# EAGLE design Emetteur2.2 (EAGLE 7.7.0)

## Sheet 1 of 2
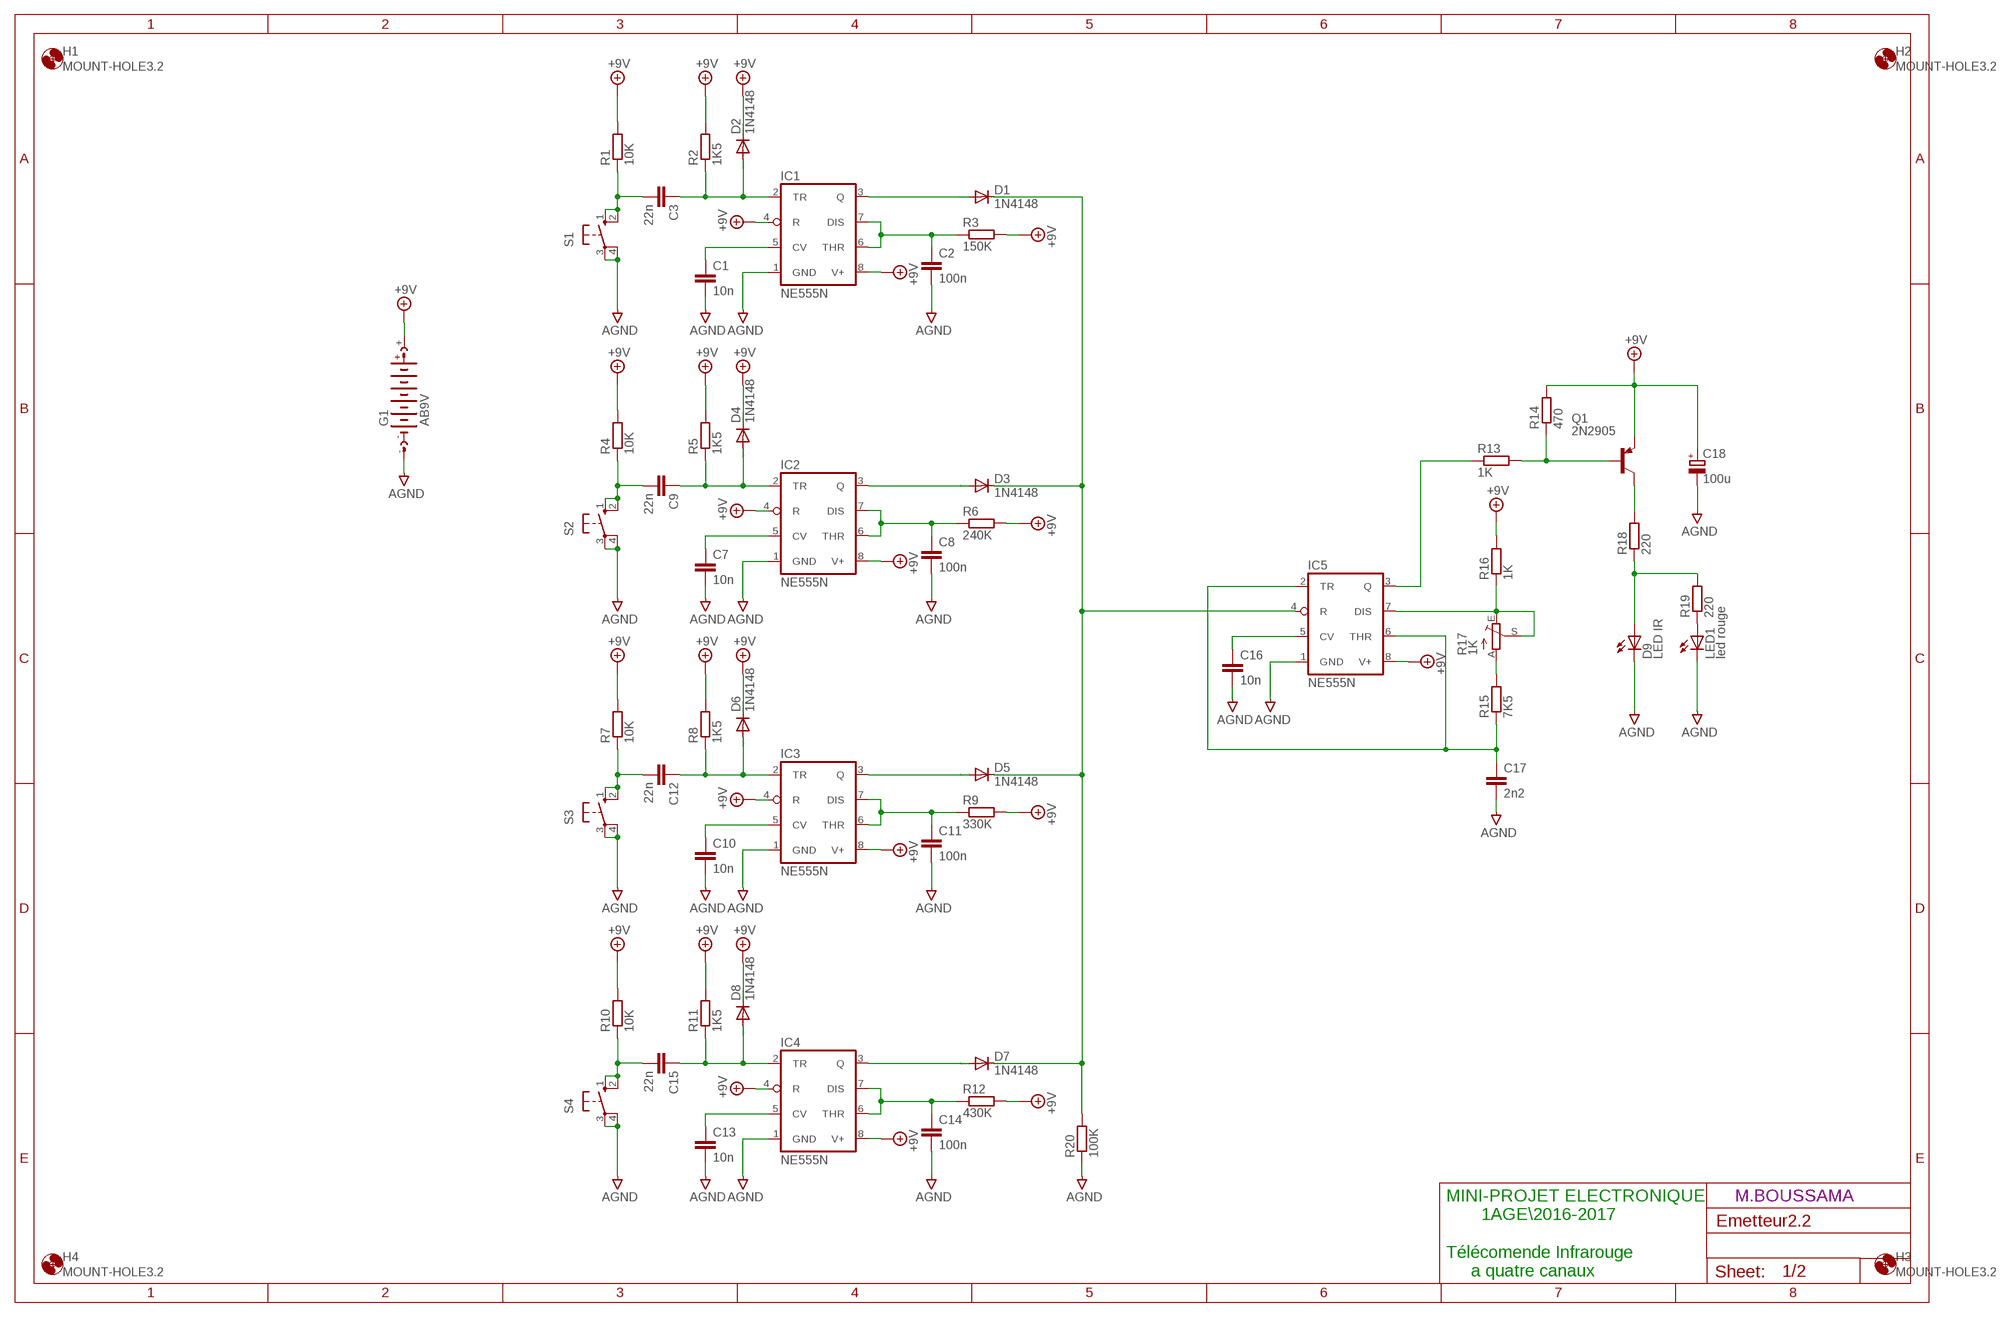
[diagram p0: schematic, sheet 1]

### Parts
C1  10n  C-EU050-025X075  [C050-025X075]
C2  100n  C-EU050-030X075  [C050-030X075]
C3  22n  C-EU050-025X075  [C050-025X075]
C7  10n  C-EU050-025X075  [C050-025X075]
C8  100n  C-EU050-030X075  [C050-030X075]
C9  22n  C-EU050-025X075  [C050-025X075]
C10  10n  C-EU050-025X075  [C050-025X075]
C11  100n  C-EU050-030X075  [C050-030X075]
C12  22n  C-EU050-025X075  [C050-025X075]
C13  10n  C-EU050-025X075  [C050-025X075]
C14  100n  C-EU050-030X075  [C050-030X075]
C15  22n  C-EU050-025X075  [C050-025X075]
C16  10n  C-EU050-025X075  [C050-025X075]
C17  2n2  C-EU050-025X075  [C050-025X075]
C18  100u  CPOL-EUE5-4  [E5-4]
D1  1N4148  1N4148DO35-7  [DO35-7]
D2  1N4148  1N4148DO35-7  [DO35-7]
D3  1N4148  1N4148DO35-7  [DO35-7]
D4  1N4148  1N4148DO35-7  [DO35-7]
D5  1N4148  1N4148DO35-7  [DO35-7]
D6  1N4148  1N4148DO35-7  [DO35-7]
D7  1N4148  1N4148DO35-7  [DO35-7]
D8  1N4148  1N4148DO35-7  [DO35-7]
D9  LED IR  SFH482  [SFH482]
G1  AB9V  [AB9V]
H1  MOUNT-HOLE3.2  [3,2]
H2  MOUNT-HOLE3.2  [3,2]
H3  MOUNT-HOLE3.2  [3,2]
H4  MOUNT-HOLE3.2  [3,2]
IC1  NE555N  [DIL08]
IC2  NE555N  [DIL08]
IC3  NE555N  [DIL08]
IC4  NE555N  [DIL08]
IC5  NE555N  [DIL08]
LED1  led rouge  LED3MM  [LED3MM]
Q1  2N2905  [TO5]
R1  10K  R-EU_0207/12  [0207/12]
R2  1K5  R-EU_0207/10  [0207/10]
R3  150K  R-EU_0204/7  [0204/7]
R4  10K  R-EU_0207/12  [0207/12]
R5  1K5  R-EU_0207/10  [0207/10]
R6  240K  R-EU_0204/7  [0204/7]
R7  10K  R-EU_0207/12  [0207/12]
R8  1K5  R-EU_0207/10  [0207/10]
R9  330K  R-EU_0204/7  [0204/7]
R10  10K  R-EU_0207/12  [0207/12]
R11  1K5  R-EU_0207/10  [0207/10]
R12  430K  R-EU_0204/7  [0204/7]
R13  1K  R-EU_0207/12  [0207/12]
R14  470  R-EU_0207/10  [0207/10]
R15  7K5  R-EU_0207/10  [0207/10]
R16  1K  R-EU_0207/12  [0207/12]
R17  1K  TRIM_EU-B25P  [B25P]
R18  220  R-EU_0207/10  [0207/10]
R19  220  R-EU_0207/10  [0207/10]
R20  100K  R-EU_0207/10  [0207/10]
S1  10-XX  [B3F-10XX]
S2  10-XX  [B3F-10XX]
S3  10-XX  [B3F-10XX]
S4  10-XX  [B3F-10XX]

### Nets
+9V: C18.+ D2.C D4.C D6.C D8.C G1.+ IC1.4(R) IC1.8(V+) IC2.4(R) IC2.8(V+) IC3.4(R) IC3.8(V+) IC4.4(R) IC4.8(V+) IC5.8(V+) Q1.1(E) R1.2 R2.2 R3.2 R4.2 R5.2 R6.2 R7.2 R8.2 R9.2 R10.2 R11.2 R12.2 R14.2 R16.2
AGND: C1.2 C2.2 C7.2 C8.2 C10.2 C11.2 C13.2 C14.2 C16.2 C17.2 C18.- D9.K(C) G1.- IC1.1(GND) IC2.1(GND) IC3.1(GND) IC4.1(GND) IC5.1(GND) LED1.K(C) R20.1 S1.3(P) S1.4(P1) S2.3(P) S2.4(P1) S3.3(P) S3.4(P1) S4.3(P) S4.4(P1)
N$1: C1.1 IC1.5(CV)
N$2: C3.1 D2.A IC1.2(TR) R2.1
N$3: C2.1 IC1.6(THR) IC1.7(DIS) R3.1
N$4: C3.2 R1.1 S1.1(S) S1.2(S1)
N$5: D1.A IC1.3(Q)
N$6: IC5.3(Q) R13.1
N$7: C7.1 IC2.5(CV)
N$8: C9.1 D4.A IC2.2(TR) R5.1
N$9: C8.1 IC2.6(THR) IC2.7(DIS) R6.1
N$10: C9.2 R4.1 S2.1(S) S2.2(S1)
N$11: D3.A IC2.3(Q)
N$12: D1.C D3.C D5.C D7.C IC5.4(R) R20.2
N$13: C10.1 IC3.5(CV)
N$14: C12.1 D6.A IC3.2(TR) R8.1
N$15: C11.1 IC3.6(THR) IC3.7(DIS) R9.1
N$16: C12.2 R7.1 S3.1(S) S3.2(S1)
N$17: D5.A IC3.3(Q)
N$18: Q1.3(C) R18.2
N$19: C13.1 IC4.5(CV)
N$20: C15.1 D8.A IC4.2(TR) R11.1
N$21: C14.1 IC4.6(THR) IC4.7(DIS) R12.1
N$22: C15.2 R10.1 S4.1(S) S4.2(S1)
N$23: D7.A IC4.3(Q)
N$24: R15.2 R17.A
N$25: C16.1 IC5.5(CV)
N$26: C17.1 IC5.2(TR) IC5.6(THR) R15.1
N$27: IC5.7(DIS) R16.1 R17.E R17.S
N$28: Q1.2(B) R13.2 R14.1
N$29: D9.A R18.1 R19.2
N$30: LED1.A R19.1

### Notes on the sheet
- M.BOUSSAMA
- MINI-PROJET ELECTRONIQUE 
         1AGE\2016-2017
  
  Télécomende Infrarouge 
       a quatre canaux

## Sheet 2 of 2
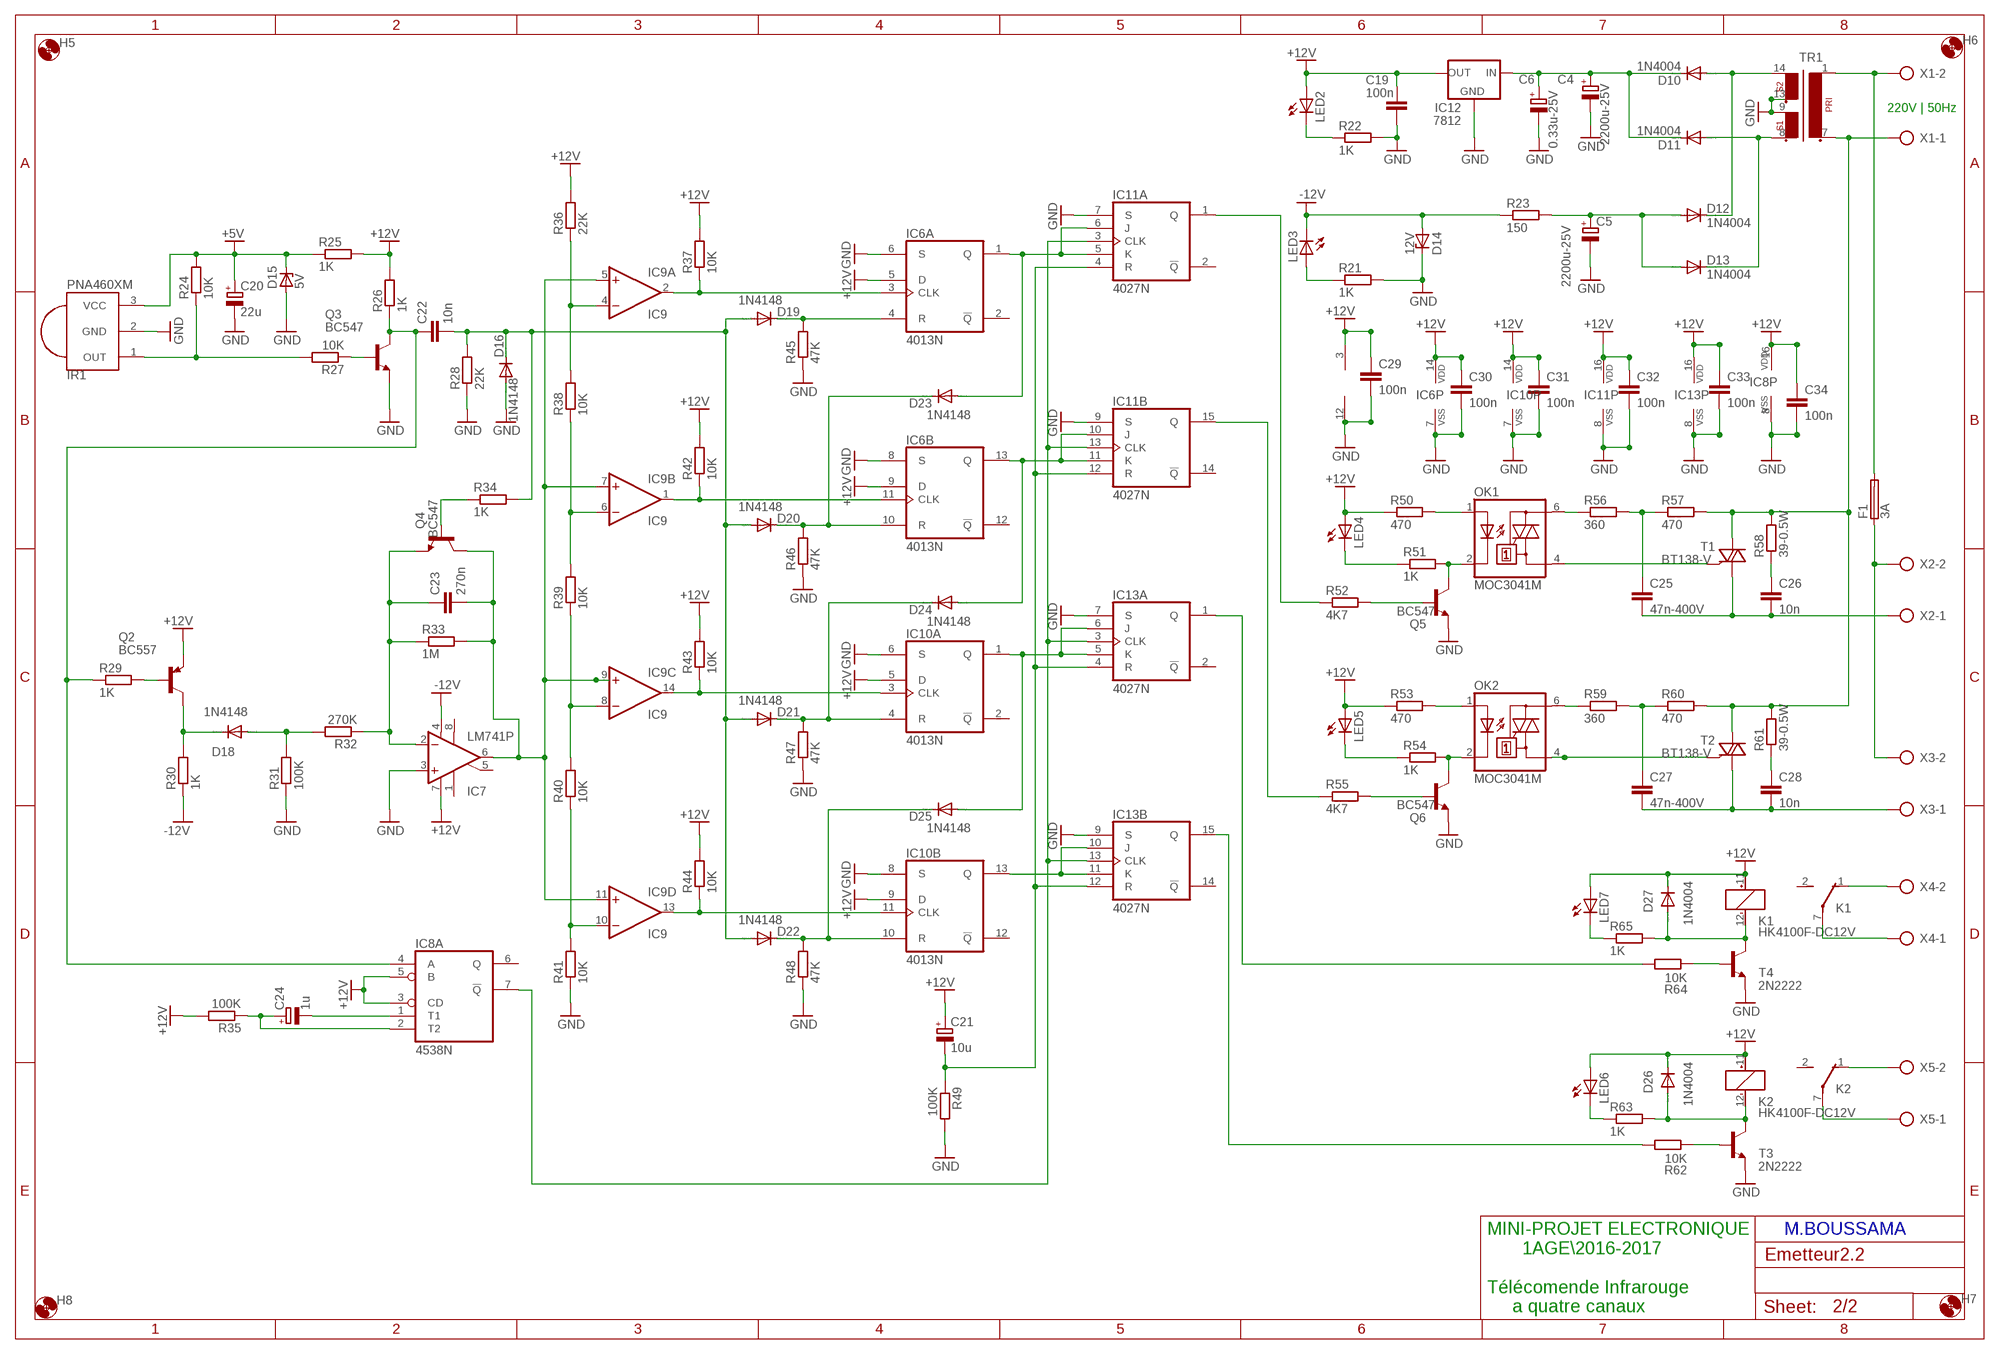
[diagram p1: schematic, sheet 2]

### Parts
C4  2200u-25V  CPOL-EUE5-13  [E5-13]
C5  2200u-25V  CPOL-EUE5-13  [E5-13]
C6  0.33u-25V  CPOL-EUE5-5  [E5-5]
C19  100n  C-EU050-025X075  [C050-025X075]
C20  22u  CPOL-EUE2.5-6  [E2,5-6]
C21  10u  CPOL-EUE2,5-6E  [E2,5-6E]
C22  10n  C-EU050-025X075  [C050-025X075]
C23  270n  C-EU050-035X075  [C050-035X075]
C24  1u  CPOL-EUE2,5-6E  [E2,5-6E]
C25  47n-400V  C-EU150-054X183  [C150-054X183]
C26  10n  C-EU102-043X133  [C102-043X133]
C27  47n-400V  C-EU150-054X183  [C150-054X183]
C28  10n  C-EU102-043X133  [C102-043X133]
C29  100n  C-EU050-025X075  [C050-025X075]
C30  100n  C-EU050-025X075  [C050-025X075]
C31  100n  C-EU050-025X075  [C050-025X075]
C32  100n  C-EU050-025X075  [C050-025X075]
C33  100n  C-EU050-025X075  [C050-025X075]
C34  100n  C-EU050-025X075  [C050-025X075]
D10  1N4004  [DO41-10]
D11  1N4004  [DO41-10]
D12  1N4004  [DO41-10]
D13  1N4004  [DO41-10]
D14  12V  1N4728  [DO41Z10]
D15  5V  1N4728  [DO41Z10]
D16  1N4148  1N4148DO35-10  [DO35-10]
D18  1N4148  1N4148DO35-7  [DO35-7]
D19  1N4148  1N4148DO35-10  [DO35-10]
D20  1N4148  BY609  [SOD61B]
D21  1N4148  1N4148DO35-10  [DO35-10]
D22  1N4148  BY609  [SOD61B]
D23  1N4148  1N4148DO35-10  [DO35-10]
D24  1N4148  BY609  [SOD61B]
D25  1N4148  1N4148DO35-10  [DO35-10]
D26  1N4004  [DO41-10]
D27  1N4004  [DO41-10]
F1  3A  FUSEGSH15  [GSH15]
H5  MOUNT-HOLE3.2  [3,2]
H6  MOUNT-HOLE3.2  [3,2]
H7  MOUNT-HOLE3.2  [3,2]
H8  MOUNT-HOLE3.2  [3,2]
IC6  4013N  [DIL14]
IC7  LM741P  [DIL08]
IC8  4538N  [DIL16]
IC9  IC9  LM339N  [DIL14]
IC10  4013N  [DIL14]
IC11  4027N  [DIL16]
IC12  7812  78XXS  [78XXS]
IC13  4027N  [DIL16]
IR1  PNA460XM  [PNA460XM]
K1  HK4100F-DC12V  [SMR1]
K2  HK4100F-DC12V  [SMR1]
LED2  LED3MM  [LED3MM]
LED3  LED3MM  [LED3MM]
LED4  LED3MM  [LED3MM]
LED5  LED3MM  [LED3MM]
LED6  LED3MM  [LED3MM]
LED7  LED3MM  [LED3MM]
OK1  MOC3041M  [DIL06]
OK2  MOC3041M  [DIL06]
Q2  BC557  [TO92-EBC]
Q3  BC547  BC548  [TO92-EBC]
Q4  BC547  BC548  [TO92-EBC]
Q5  BC547  BC548  [TO92-EBC]
Q6  BC547  BC548  [TO92-EBC]
R21  1K  R-EU_0207/10  [0207/10]
R22  1K  R-EU_0207/10  [0207/10]
R23  150  R-EU_0207/10  [0207/10]
R24  10K  R-EU_0207/10  [0207/10]
R25  1K  R-EU_0207/10  [0207/10]
R26  1K  R-EU_0207/12  [0207/12]
R27  10K  R-EU_0207/10  [0207/10]
R28  22K  R-EU_0207/10  [0207/10]
R29  1K  R-EU_0207/15  [0207/15]
R30  1K  R-EU_0207/10  [0207/10]
R31  100K  R-EU_0207/10  [0207/10]
R32  270K  R-EU_0207/12  [0207/12]
R33  1M  R-EU_0207/10  [0207/10]
R34  1K  R-EU_0207/12  [0207/12]
R35  100K  R-EU_0207/10  [0207/10]
R36  22K  R-EU_0207/10  [0207/10]
R37  10K  R-EU_0207/10  [0207/10]
R38  10K  R-EU_0207/10  [0207/10]
R39  10K  R-EU_0207/10  [0207/10]
R40  10K  R-EU_0207/10  [0207/10]
R41  10K  R-EU_0207/10  [0207/10]
R42  10K  R-EU_0207/10  [0207/10]
R43  10K  R-EU_0207/10  [0207/10]
R44  10K  R-EU_0207/10  [0207/10]
R45  47K  R-EU_0207/12  [0207/12]
R46  47K  R-EU_0207/12  [0207/12]
R47  47K  R-EU_0207/12  [0207/12]
R48  47K  R-EU_0207/10  [0207/10]
R49  100K  R-EU_0207/12  [0207/12]
R50  470  R-EU_0207/10  [0207/10]
R51  1K  R-EU_0207/10  [0207/10]
R52  4K7  R-EU_0207/10  [0207/10]
R53  470  R-EU_0207/10  [0207/10]
R54  1K  R-EU_0207/10  [0207/10]
R55  4K7  R-EU_0207/10  [0207/10]
R56  360  R-EU_0207/10  [0207/10]
R57  470  R-EU_0207/10  [0207/10]
R58  39-0.5W  R-EU_0207/10  [0207/10]
R59  360  R-EU_0207/10  [0207/10]
R60  470  R-EU_0207/10  [0207/10]
R61  39-0.5W  R-EU_0207/10  [0207/10]
R62  10K  R-EU_0207/12  [0207/12]
R63  1K  R-EU_0207/10  [0207/10]
R64  10K  R-EU_0207/12  [0207/12]
R65  1K  R-EU_0207/10  [0207/10]
T1  BT138-V  [TO220BV]
T2  BT138-V  [TO220BV]
T3  2N2222  [TO92-EBC-OVAL]
T4  2N2222  [TO92-EBC-OVAL]
TR1  EI54-2  [EI54-2]
X1  AK300/2  [AK300/2]
X2  AK300/2  [AK300/2]
X3  AK300/2  [AK300/2]
X4  AK300/2  [AK300/2]
X5  AK300/2  [AK300/2]

### Nets
+5V: C20.+ D15.C IR1.3(VCC) R24.2 R25.1
+12V: C19.1 C21.+ C29.1 C30.1 C31.1 C32.1 C33.1 C34.1 D26.C D27.C IC6.5(A:D) IC6.9(B:D) IC6.14(P:VDD) IC7.7(V+) IC8.3(A:CD) IC8.5(A:B) IC8.16(P:VDD) IC9.3(P:V+) IC10.5(A:D) IC10.9(B:D) IC10.14(P:VDD) IC11.16(P:VDD) IC12.OUT IC13.16(P:VDD) K1.11(+) K2.11(+) LED2.A LED4.A LED5.A LED6.A LED7.A Q2.E R25.2 R26.2 R35.2 R36.2 R37.2 R42.2 R43.2 R44.2 R50.1 R53.1
-12V: D14.A IC7.4(V-) LED3.K(C) R23.1 R30.1
GND: C4.- C5.- C6.- C19.2 C20.- C29.2 C30.2 C31.2 C32.2 C33.2 C34.2 D14.C D15.A D16.A IC6.6(A:S) IC6.7(P:VSS) IC6.8(B:S) IC7.3(+IN) IC8.8(P:VSS) IC9.12(P:GND) IC10.6(A:S) IC10.7(P:VSS) IC10.8(B:S) IC11.7(A:S) IC11.8(P:VSS) IC11.9(B:S) IC12.GND IC13.7(A:S) IC13.8(P:VSS) IC13.9(B:S) IR1.2(GND) Q3.E Q5.E Q6.E R21.2 R22.2 R28.1 R31.1 R41.1 R45.1 R46.1 R47.1 R48.1 R49.2 T3.E T4.E TR1.9 TR1.13
N$31: F1.2 TR1.1 X1.2
N$32: R57.2 R58.2 R60.2 R61.2 T1.T2(A2) T2.T2(A2) TR1.7 X1.1
N$33: Q3.B R27.1
N$34: D10.A D12.C TR1.14
N$35: D11.A D13.C TR1.8
N$36: C4.+ C6.+ D10.C D11.C IC12.IN
N$37: C5.+ D12.A D13.A R23.2
N$38: LED3.A R21.1
N$39: IR1.1(OUT) R24.1 R27.2
N$40: IC6.3(A:CLK) IC9.2(A:OUT) R37.1
N$41: LED2.K(C) R22.1
N$42: Q2.B R29.2
N$43: D18.C Q2.C R30.2
N$44: D18.A R31.2 R32.2
N$45: C23.1 IC7.2(-IN) Q4.E R32.1 R33.1
N$46: D20.C D23.C IC6.10(B:R) R46.2
N$47: C22.1 IC8.4(A:A) Q3.C R26.1 R29.1
N$48: C23.2 IC7.6(OUT) IC9.5(A:+IN) IC9.7(B:+IN) IC9.9(C:+IN) IC9.11(D:+IN) Q4.C R33.2
N$49: Q4.B R34.1
N$51: C24.+ IC8.2(A:T2) R35.1
N$52: C24.- IC8.1(A:T1)
N$53: IC9.4(A:-IN) R36.1 R38.2
N$54: IC9.10(D:-IN) R40.1 R41.2
N$55: IC9.8(C:-IN) R39.1 R40.2
N$56: IC9.6(B:-IN) R38.1 R39.2
N$57: IC6.11(B:CLK) IC9.1(B:OUT) R42.1
N$58: IC9.14(C:OUT) IC10.3(A:CLK) R43.1
N$59: IC9.13(D:OUT) IC10.11(B:CLK) R44.1
N$60: D23.A IC6.1(A:Q) IC11.5(A:K) IC11.6(A:J)
N$61: D24.A IC6.13(B:Q) IC11.10(B:J) IC11.11(B:K)
N$62: Q5.B R52.2
N$63: IC10.13(B:Q) IC13.10(B:J) IC13.11(B:K)
N$64: C21.- IC11.4(A:R) IC11.12(B:R) IC13.4(A:R) IC13.12(B:R) R49.1
N$65: D25.A IC10.1(A:Q) IC13.5(A:K) IC13.6(A:J)
N$66: IC11.1(A:Q) R52.1
N$68: LED4.K(C) R51.1
N$69: OK1.2(C) Q5.C R51.2
N$70: Q6.B R55.2
N$71: IC11.15(B:Q) R55.1
N$72: LED5.K(C) R54.1
N$73: OK2.2(C) Q6.C R54.2
N$74: OK1.1(A) R50.2
N$75: OK2.1(A) R53.2
N$76: F1.1 X2.2 X3.2
N$77: C27.1 R59.2 R60.1
N$78: C25.1 R56.2 R57.1
N$79: C25.2 C26.2 T1.T1(A1) X2.1
N$80: C26.1 R58.1
N$81: C27.2 C28.2 T2.T1(A1) X3.1
N$82: OK1.4(A1) T1.G
N$83: D26.A K2.12(-) R63.2 T3.C
N$84: C28.1 R61.1
N$85: OK2.4(A1) T2.G
N$86: OK1.6(A2) R56.1
N$87: OK2.6(A2) R59.1
N$88: R62.1 T3.B
N$89: K2.1(O) X5.2
N$90: K2.7(P) X5.1
N$91: LED6.K(C) R63.1
N$92: D27.A K1.12(-) R65.2 T4.C
N$93: R64.1 T4.B
N$94: K1.7(P) X4.1
N$95: K1.1(O) X4.2
N$96: LED7.K(C) R65.1
N$97: IC13.1(A:Q) R64.2
N$98: IC13.15(B:Q) R62.2
N$104: IC8.7(A:!Q) IC11.3(A:CLK) IC11.13(B:CLK) IC13.3(A:CLK) IC13.13(B:CLK)
N$109: D22.C D25.C IC10.10(B:R) R48.2
N$110: D19.C IC6.4(A:R) R45.2
N$111: C22.2 D16.C D19.A D20.A D21.A D22.A R28.2 R34.2
N$112: D21.C D24.C IC10.4(A:R) R47.2
Unconnected: IC6.2(A:!Q) IC6.12(B:!Q) IC7.1(ON1) IC7.5(ON2) IC7.8(OPT) IC8.6(A:Q) IC8.9(B:!Q) IC8.10(B:Q) IC8.11(B:B) IC8.12(B:A) IC8.13(B:CD) IC8.14(B:T2) IC8.15(B:T1) IC10.2(A:!Q) IC10.12(B:!Q) IC11.2(A:!Q) IC11.14(B:!Q) IC13.2(A:!Q) IC13.14(B:!Q) K1.2(S) K2.2(S)

### Notes on the sheet
- 220V | 50Hz
- M.BOUSSAMA
- MINI-PROJET ELECTRONIQUE 
         1AGE\2016-2017
  
  Télécomende Infrarouge 
       a quatre canaux

## Library data of the parts
C1-C3 C7-C17 C19 C22 C23 C25-C34 = rcl:C-EU: CAPACITOR, European symbol
C4-C6 C18 C20 C21 C24 = rcl:CPOL-EU: POLARIZED CAPACITOR, European symbol
D1-D8 D16 D18 D19 D21 D23 D25 = diode:1N4148: DIODE high speed (Philips)
D9 = led:SFH482: IR LED infrared emitting diode, Infineon
D10-D13 D26 D27 = diode:1N4004: DIODE general purpose rectifier, 1 A
D14 D15 = diode:1N4728: Z DIODE 3.3 V, 1W, 5 percent
D20 D22 D24 = diode:BY609: DIODE
F1 = fuse:FUSE: Fuse; OC_FARNELL: unknown; OC_NEWARK: unknown
G1 = battery:AB9V: 9-V BATTERY CLIP
H1-H8 = holes:MOUNT-HOLE: MOUNTING HOLE with drill center marker
IC1-IC5 = linear:*555: TIMER
IC6 IC10 = 40xx:4013: Dual D FLIP FLOP, set/reset
IC7 = linear:*741: OP AMP
IC8 = 45xx:4538: Dual precision monostable MULTIVIBRATOR
IC9 = linear:LM339: Low Power Low Offset Voltage Quad Comparators with open collector; LM139/LM239/LM339/LM2901/LM3302
IC11 IC13 = 40xx:4027: Dual JK FLIP FLOP
IC12 = v-reg:78XXS: VOLTAGE REGULATOR
IR1 = adafruit:PNA460XM: IR 38KHz receiver PNA4602 and related receivers http://www.ladyada.net/library/pcb/eaglelibrary.html
K1 K2 = huike:HK410?F-*: HUIKE (Fujitsu) subminaiture relay www.szunion-tech.com
LED1-LED7 = led:LED: LED OSRAM: - CHIPLED LG R971, LG N971, LY N971, LG Q971, LY Q971, LO R971, LY R971 LH N974, LH R974 LS Q976, LO Q976, LY Q976 LO Q996 - Hyper CHIPLED LW Q18S LB Q993, LB Q99A, LB R99A - SideLED LS A670, LO A670, LY A670, LG A670, LP A670 LB A673, LV A673, LT A673, LW A673 LH A674 LY A675 LS A676, LA A676, LO A676, LY A676, LW A676 LS A679, LY A679, LG A679 - Hyper Micro SIDELED® LS Y876, LA Y876, LO Y876, LY Y876 LT Y87S - SmartLED LW L88C, LW L88S LB L89C, LB L89S, LG L890 LS L89K, LO L89K, LY L89K LS L896, LA L896, LO L896, LY L896 - TOPLED LS T670, LO T670, LY T670, LG T670, LP T670 LSG T670, LSP T670, LSY T670, LOP T670, LYG T670 LG T671, LOG T671, LSG T671 LB T673, LV T673, LT T673, LW T673 LH T674 LS T676, LA T676, LO T676, LY T676, LB T676, LH T676, LSB T676, LW T676 LB T67C, LV T67C, LT T67C, LS T67K, LO T67K, LY T67K, LW E67C LS E67B, LA E67B, LO E67B, LY E67B, LB E67C, LV E67C, LT E67C LW T67C LS T679, LY T679, LG T679 LS T770, LO T770, LY T770, LG T770, LP T770 LB T773, LV T773, LT T773, LW T773 LH T774 LS E675, LA E675, LY E675, LS T675 LS T776, LA T776, LO T776, LY T776, LB T776 LHGB T686 LT T68C, LB T68C - Hyper Mini TOPLED® LB M676 - Mini TOPLED Santana® LG M470 LS M47K, LO M47K, LY M47K Source: http://www.osram.convergy.de LUXEON: - LUMILED® LXK2-PW12-R00, LXK2-PW12-S00, LXK2-PW14-U00, LXK2-PW14-V00 LXK2-PM12-R00, LXK2-PM12-S00, LXK2-PM14-U00 LXK2-PE12-Q00, LXK2-PE12-R00, LXK2-PE12-S00, LXK2-PE14-T00, LXK2-PE14-U00 LXK2-PB12-K00, LXK2-PB12-L00, LXK2-PB12-M00, LXK2-PB14-N00, LXK2-PB14-P00, LXK2-PB14-Q00 LXK2-PR12-L00, LXK2-PR12-M00, LXK2-PR14-Q00, LXK2-PR14-R00 LXK2-PD12-Q00, LXK2-PD12-R00, LXK2-PD12-S00 LXK2-PH12-R00, LXK2-PH12-S00 LXK2-PL12-P00, LXK2-PL12-Q00, LXK2-PL12-R00 Source: www.luxeon.com KINGBRIGHT: KA-3528ASYC Source: www.kingbright.com
OK1 OK2 = optocoupler:MOC30*: 6-Pin DIP Zero-Cross Optoisolators Triac Driver Output (250/400 Volt Peak) Source: Data sheet <http://www.fairchildsemi.com/ds/MO/MOC3031M.pdf> The old path of data sheet not more available 2013-05-06.; MF: FAIRCHILD SEMICONDUCTOR; MPN: MOC3041M; OC_FARNELL: 1086677; OC_NEWARK: 78K6090
Q1 = transistor-pnp:2N2905: PNP Transistor
Q2 = transistor-pnp:BC557*: PNP Transistror
Q3-Q6 = transistor-npn:BC548*: NPN Transistor
R1-R16 R18-R65 = rcl:R-EU_: RESISTOR, European symbol
R17 = pot:TRIM_EU-: POTENTIOMETER
S1-S4 = switch-omron:10-XX: OMRON SWITCH; MPN: B3F-1000; OC_FARNELL: 176432; OC_NEWARK: 36M3542
T1 T2 = triac:BT138: TRIAC Source: http://www.semiconductors.philips.com BT138_SERIES_2.pdf
T3 T4 = adafruit:2N2222: NPN TRANSISTOR Big oval pads
TR1 = trafo:EI54-2: TRANSFORMER 1 primary winding, 2 secondary windings ERA
X1-X5 = con-ptr500:AK300/2: CONNECTOR; OC_FARNELL: unknown; OC_NEWARK: unknown

## Board
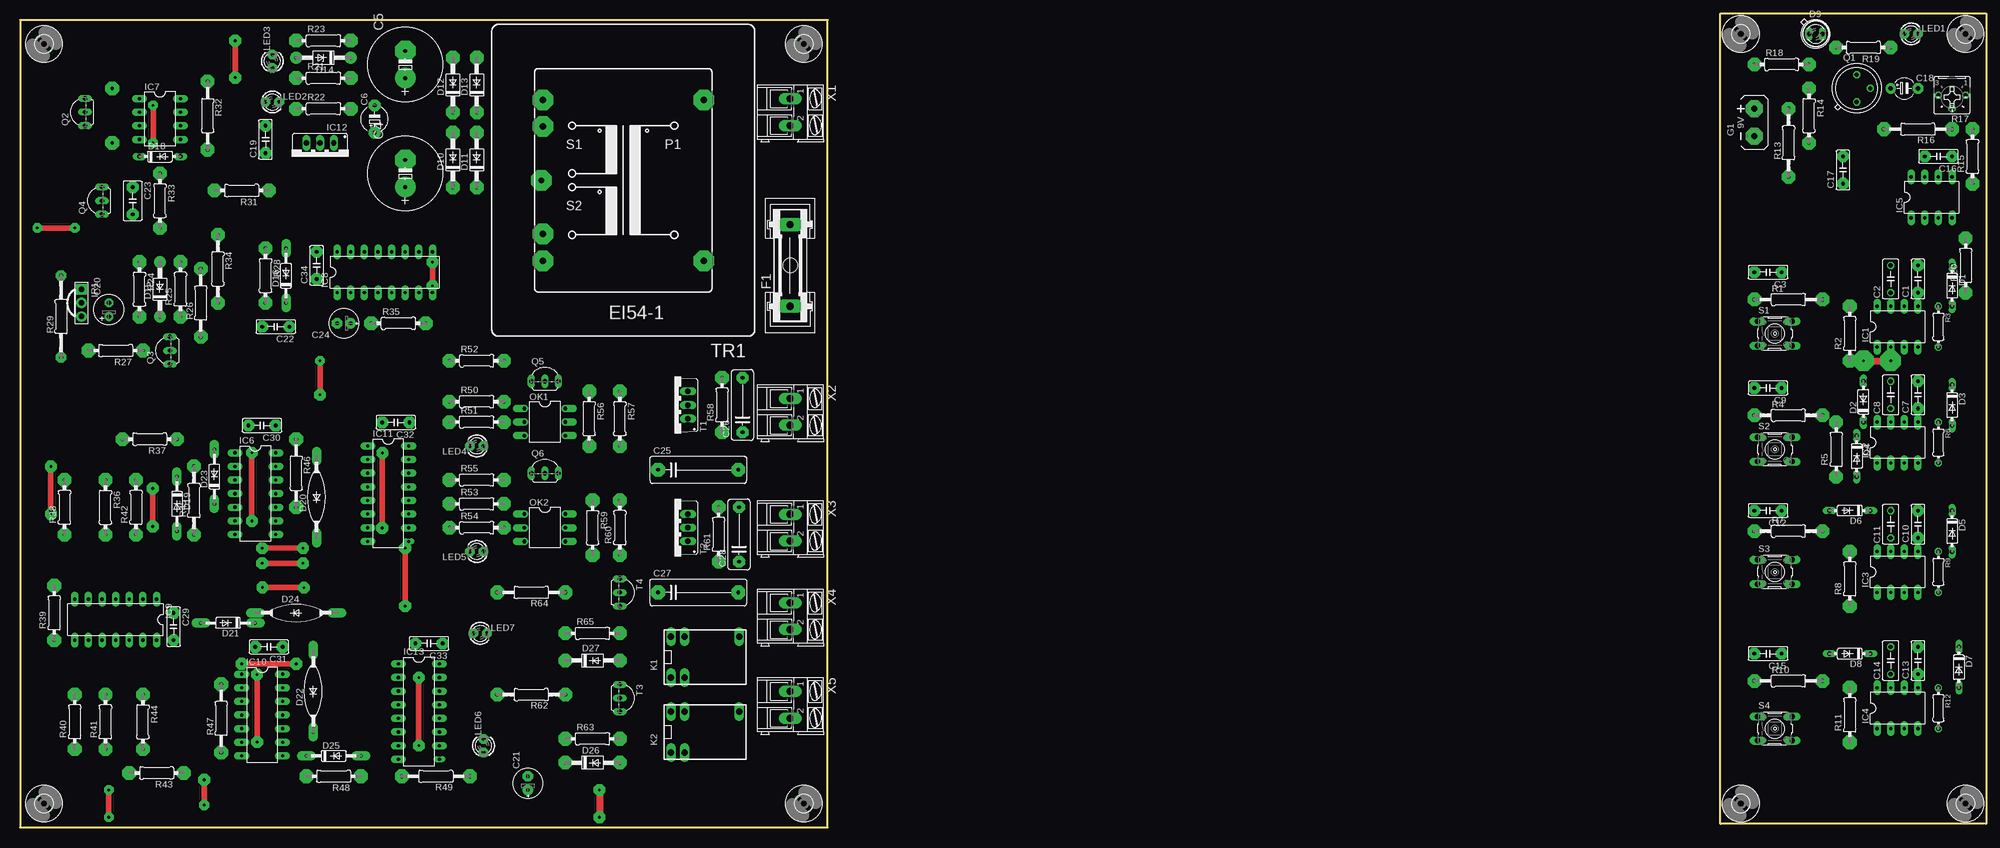
[diagram p2: board, top side]
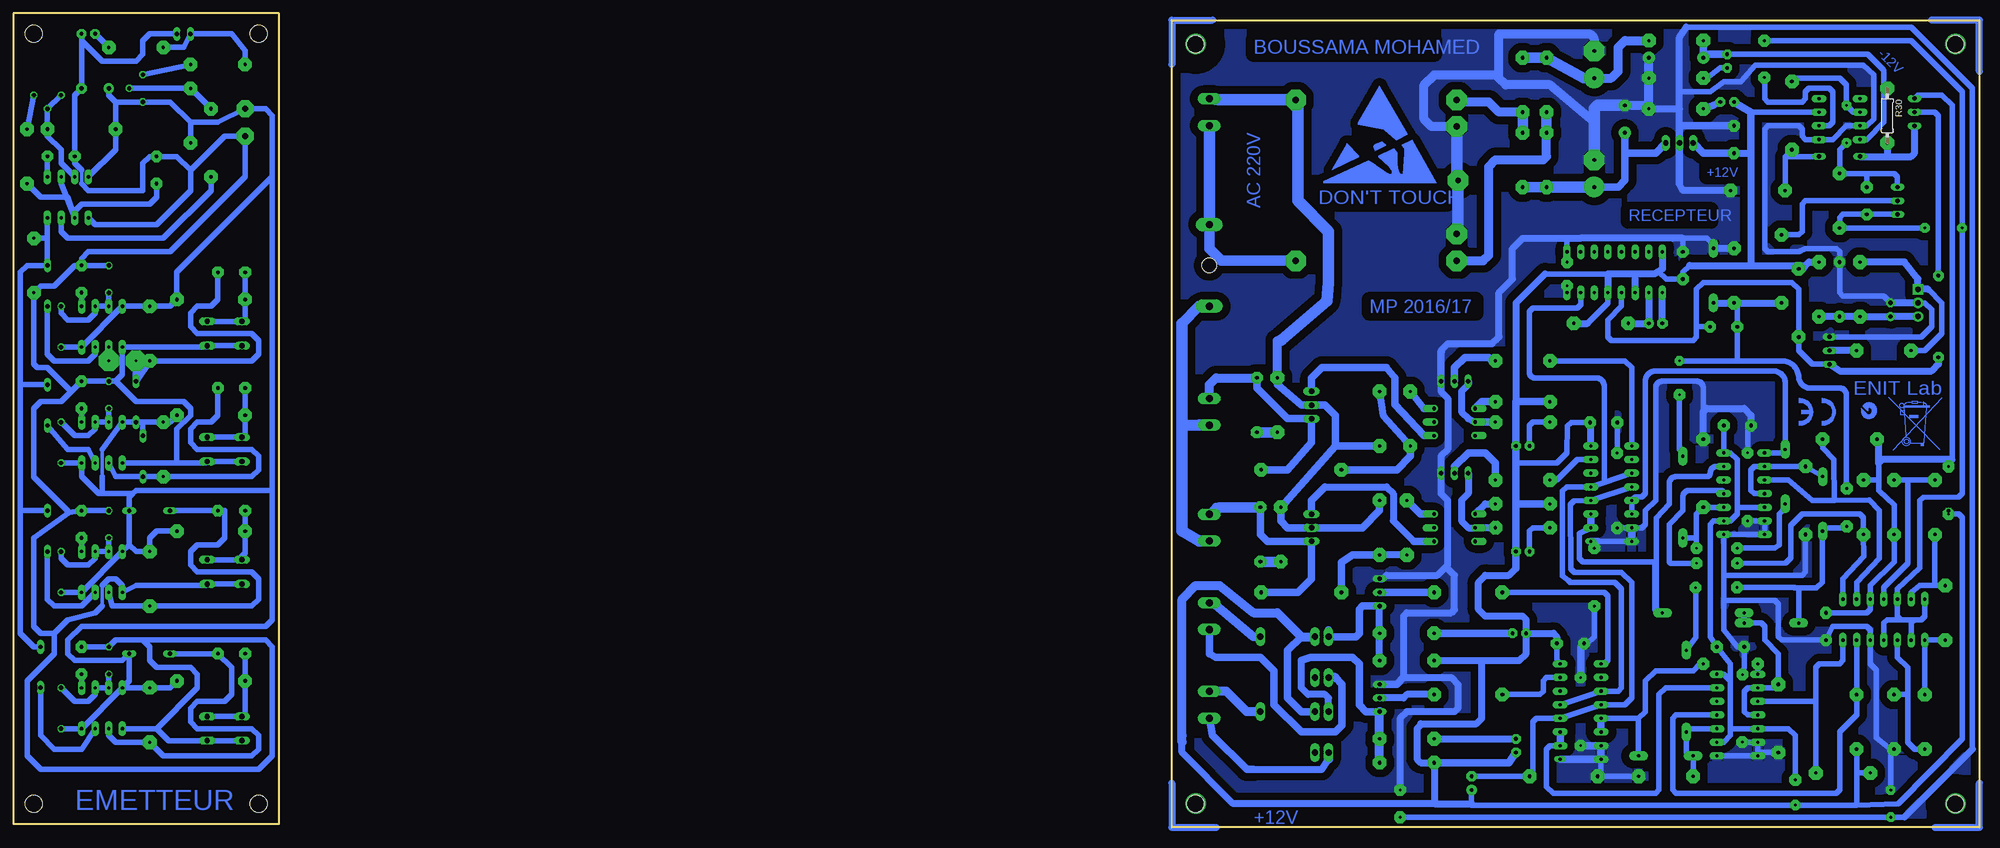
[diagram p3: board, bottom side, seen from below]

Size 366.39 x 151.76 mm. Coordinates in mm from the lower left corner, seen from the top.
Outline: 316.87,151.76 366.39,151.76 366.39,0.64 316.87,0.64 316.87,151.76
Outline: 0,150.5 0,0 150.5,0 150.5,150.5 0,150.5
Copper layers (1*16): Top 0.035mm / dielectric 1.5mm / Bottom 0.035mm
Design rules "default *": minimum track width 10mil, minimum drill 24mil, track to track 8mil, track to pad 8mil, pad to pad 8mil, via to via 8mil, smd to smd 10mil, copper to edge 40mil, drill to drill 8mil, minimum pad ring 10mil, minimum via ring 8mil, stop-mask expansion 4mil, vias tented up to drill 0mil, thermal gap 10mil

### Footprints (pad centres in the part's own frame; a part is rotated, then mirrored left to right if it is on the bottom)
C050-025X075 = drill 0.7 pad 2.184 octagon: 1 -2.54,0; 2 2.54,0
C050-030X075 = drill 0.813 octagon: 1 -2.54,0; 2 2.54,0
E5-13 = drill 0.7 pad 3.81: + -2.54,0 | drill 0.7 pad 3.81 octagon: - 2.54,0
E5-5 = drill 0.7 pad 2.184: + -2.54,0 | drill 0.7 pad 2.184 octagon: - 2.54,0
E5-4 = drill 0.813 pad 1.905: + -2.54,0 | drill 0.813 pad 1.905 octagon: - 2.54,0
E2,5-6 = drill 0.813 pad 1.6: + -1.27,0 | drill 0.813 pad 1.6 octagon: - 1.27,0
E2,5-6E = drill 0.7 pad 1.93: + -1.27,0 | drill 0.7 pad 1.93 octagon: - 1.27,0
C050-035X075 = drill 0.7 pad 2.184 octagon: 1 -2.54,0; 2 2.54,0
C150-054X183 = drill 0.7 pad 2.54 octagon: 1 -7.493,0; 2 7.493,0
C102-043X133 = drill 0.7 pad 2.184 octagon: 1 -5.08,0; 2 5.08,0
DO35-7 = drill 0.813 long: A 3.81,0; C -3.81,0
SFH482 = drill 0.813 long: A -1.27,0; K 1.27,0
DO41-10 = drill 0.7 pad 2.54 octagon: A 5.08,0; C -5.08,0
DO41Z10 = drill 0.7 pad 2.184: A 5.08,0; C -5.08,0
DO35-10 = drill 0.6 pad 1.778 long: A 5.08,0; C -5.08,0
SOD61B = drill 0.6 pad 1.778 long: A 7.62,0; C -7.62,0
GSH15 = drill 1.321 pad 2.54 long: 1 -7.62,0; 2 7.62,0 | hole 2.794: 0,0
AB9V = drill 1.118 pad 3.15 octagon: + 0,2.54; - 0,-2.54
3,2 = hole 3.2: 0,0
DIL08 = drill 0.6 pad 1.422 long: 1 -3.81,-3.81; 2 -1.27,-3.81; 3 1.27,-3.81; 4 3.81,-3.81; 5 3.81,3.81; 6 1.27,3.81; 7 -1.27,3.81; 8 -3.81,3.81
DIL14 = drill 0.6 pad 1.422 long: 1 -7.62,-3.81; 2 -5.08,-3.81; 3 -2.54,-3.81; 4 0,-3.81; 5 2.54,-3.81; 6 5.08,-3.81; 7 7.62,-3.81; 8 7.62,3.81; 9 5.08,3.81; 10 2.54,3.81; 11 0,3.81; 12 -2.54,3.81; 13 -5.08,3.81; 14 -7.62,3.81
DIL16 = drill 0.6 pad 1.422 long: 1 -8.89,-3.81; 2 -6.35,-3.81; 3 -3.81,-3.81; 4 -1.27,-3.81; 5 1.27,-3.81; 6 3.81,-3.81; 7 6.35,-3.81; 8 8.89,-3.81; 9 8.89,3.81; 10 6.35,3.81; 11 3.81,3.81; 12 1.27,3.81; 13 -1.27,3.81; 14 -3.81,3.81; 15 -6.35,3.81; 16 -8.89,3.81
DIL16' = drill 0.6 pad 1.422 long: 1 -8.89,-3.81; 2 -6.35,-3.81; 3 -3.81,-3.81; 4 -1.27,-3.81; 5 1.27,-3.81; 6 3.81,-3.81; 7 6.35,-3.81; 8 8.89,-3.81; 10 6.35,3.81; 11 3.81,3.81; 12 1.27,3.81; 13 -1.27,3.81; 14 -3.81,3.81; 15 -6.35,3.81; 16 -8.89,3.81 | drill 0.6 pad 1.016 long: 9 8.89,3.81
78XXS = drill 1.016 long: GND 0,-2.54; IN -2.54,-2.54; OUT 2.54,-2.54
PNA460XM = drill 1.016 pad 1.93 square: 1 -2.54,0 | drill 1.016 pad 1.93: 2 0,0; 3 2.54,0
SMR1 = drill 1.2 long: 1 -6.35,-3.81; 2 -3.81,-3.81; 7 6.35,3.81; 11 -3.81,3.81; 12 -6.35,3.81
LED3MM = drill 0.7 pad 1.778 octagon: A -1.27,0; K 1.27,0
DIL06 = drill 0.7 pad 1.422 offset: 1 -2.54,-3.81; 2 0,-3.81; 3 2.54,-3.81; 4 2.54,3.81; 5 0,3.81; 6 -2.54,3.81
TO5 = drill 0.813 octagon: 1 0,-2.54; 2 2.54,0; 3 0,2.54
TO92-EBC = drill 0.813 long: B 0,-1.27; C -2.54,-1.27; E 2.54,-1.27
0207/12 = drill 0.7 pad 2.54 octagon: 1 -6.35,0; 2 6.35,0
0207/10 = drill 0.6 pad 2.54 octagon: 1 -5.08,0; 2 5.08,0
0204/7 = drill 0.813 octagon: 1 -3.81,0; 2 3.81,0
B25P = drill 0.813 octagon: A -2.54,0; E 2.54,0; S 0,2.54
0207/15 = drill 0.7 pad 1.93 octagon: 1 -7.62,0; 2 7.62,0
B3F-10XX = drill 1.016 long: 1 -3.251,2.261; 2 3.251,2.261; 3 -3.251,-2.261; 4 3.251,-2.261
TO220BV = drill 1.016 long: G 2.54,-2.54; T1 -2.54,-2.54; T2 0,-2.54
TO92-EBC-OVAL = drill 0.813 long: B 0,-1.27; C 2.54,-1.27; E -2.54,-1.27
EI54-2 = drill 1.194 pad 3.81 octagon: 1 -15.011,15.011; 7 -15.011,-15.011; 8 15.011,-15.011; 9 15.011,-10.008; 13 15.011,10.008; 14 15.011,15.011
AK300/2 = drill 1.321 pad 2.184 long: 1 -2.515,0; 2 2.489,0

### Placement (x,y rotation side)
C1  353.69,102.23 90 top
C2  348.62,102.23 90 top
C3  325.75,103.5 180 top
C4  71.75,121.92 90 top
C5  71.75,142.24 90 top
C6  66.04,132.08 90 top
C7  353.69,80.64 90 top
C8  348.62,80.64 90 top
C9  325.75,81.92 180 top
C10  353.69,56.52 90 top
C11  348.62,56.52 90 top
C12  325.75,59.05 180 top
C13  353.69,31.11 90 top
C14  348.62,31.11 90 top
C15  325.75,32.38 180 top
C16  357.5,125.09 180 top
C17  339.73,122.56 90 top
C18  351.15,137.79 0 top
C19  45.72,128.27 90 top
C20  16.51,96.52 90 top
C21  94.61,8.26 90 top
C22  47.62,93.34 180 top
C23  20.95,116.84 270 top
C24  60.33,93.98 180 top
C25  126.36,66.67 0 top
C26  134.62,78.74 90 top
C27  126.36,43.81 0 top
C28  133.99,54.61 90 top
C29  28.57,37.47 270 top
C30  45.09,74.93 180 top
C31  46.35,33.66 180 top
C32  70.01,75.5 180 top
C33  76.2,34.29 180 top
C34  55.24,104.78 90 top
D1  360.05,100.97 270 top
D2  343.54,79.38 90 top
D3  360.05,78.74 270 top
D4  342.26,69.22 270 top
D5  360.05,55.24 270 top
D6  341,59.05 180 top
D7  361.31,29.84 270 top
D8  341,32.38 180 top
D9  334.64,147.96 0 top
D10  80.64,124.46 90 top
D11  85.09,124.46 90 top
D12  80.64,138.43 90 top
D13  85.09,138.43 90 top
D14  56.52,143.51 180 top
D15  26.04,100.33 90 top
D16  49.53,102.87 90 top
D18  26.04,125.09 0 top
D19  29.21,60.33 270 top
D20  55.24,61.59 90 top
D21  38.73,38.1 180 top
D22  54.61,25.4 90 top
D23  36.2,65.41 90 top
D24  51.44,40.01 0 top
D25  58.42,13.34 0 top
D26  106.68,12.06 0 top
D27  106.68,31.11 0 top
F1  143.51,104.78 90 top
G1  323.21,131.44 0 top
H1  320.68,147.96 0 top
H2  362.58,147.96 0 top
H3  146.05,4.45 0 top
H4  146.05,146.05 0 top
H5  4.45,146.05 0 top
H6  4.45,4.45 0 top
H7  320.68,4.45 0 top
H8  362.58,4.45 0 top
IC1  349.88,93.34 0 top
IC2  349.88,71.75 0 top
IC3  349.88,47.62 0 top
IC4  349.88,22.23 0 top
IC5  356.24,117.47 0 top
IC6  43.81,62.23 270 top
IC7  26.04,132.08 270 top
IC8  67.94,103.5 0 top
IC9  17.78,38.73 180 top
IC10  45.09,20.95 270 top
IC11  4027N  [DIL16']  68.58,62.23 270 top
IC12  55.88,125.09 180 top
IC13  4027N  [DIL16']  74.3,21.59 270 top
IR1  11.43,97.79 270 top
K1  127.64,31.75 0 top
K2  127.64,17.78 0 top
LED1  352.43,147.96 0 top
LED2  46.99,135.25 0 top
LED3  46.99,142.88 90 top
LED4  85.09,71.12 180 top
LED5  85.09,51.44 180 top
LED6  86.36,15.24 90 top
LED7  85.72,36.2 0 top
OK1  97.79,75.56 270 top
OK2  97.79,55.88 270 top
Q1  342.26,137.79 0 top
Q2  10.79,133.35 90 top
Q3  26.67,88.9 90 top
Q4  13.97,116.84 90 top
Q5  97.79,84.45 0 top
Q6  97.79,67.31 0 top
R1  329.56,98.42 0 top
R2  341,92.08 90 top
R3  357.5,93.34 270 top
R4  329.56,76.83 0 top
R5  338.45,70.48 90 top
R6  357.5,71.75 270 top
R7  329.56,55.24 0 top
R8  341,46.35 90 top
R9  357.5,47.62 270 top
R10  329.56,27.3 0 top
R11  341,20.95 90 top
R12  357.5,22.23 270 top
R13  329.56,127.64 90 top
R14  333.38,132.72 270 top
R15  363.86,125.09 90 top
R16  353.69,130.18 180 top
R17  360.05,136.53 180 top
R18  328.3,142.24 0 top
R19  343.54,145.41 180 top
R20  362.58,104.78 90 top
R21  56.52,139.7 0 top
R22  56.52,133.99 0 top
R23  56.52,146.69 0 top
R24  22.23,100.33 270 top
R25  29.84,100.33 90 top
R26  33.66,97.79 90 top
R27  17.78,88.9 180 top
R28  45.72,102.87 270 top
R29  7.62,95.25 90 top
R30  17.14,132.72 270 bottom
R31  41.27,118.75 180 top
R32  34.92,132.72 270 top
R33  26.04,116.84 270 top
R34  36.83,104.14 270 top
R35  70.48,93.98 0 top
R36  15.88,59.69 270 top
R37  24.13,72.39 180 top
R38  8.26,59.69 90 top
R39  6.35,40.01 90 top
R40  10.16,19.68 90 top
R41  15.88,19.68 90 top
R42  21.59,59.69 90 top
R43  25.4,10.16 180 top
R44  22.86,19.68 270 top
R45  32.38,60.96 90 top
R46  51.44,66.04 270 top
R47  37.47,20.32 90 top
R48  58.42,9.53 180 top
R49  77.47,9.53 180 top
R50  85.09,79.38 0 top
R51  85.09,75.56 0 top
R52  85.09,87 0 top
R53  85.09,60.33 0 top
R54  85.09,55.88 0 top
R55  85.09,64.77 0 top
R56  106.05,76.2 270 top
R57  111.76,76.2 270 top
R58  130.81,78.74 90 top
R59  106.68,55.88 270 top
R60  111.76,55.88 90 top
R61  130.18,54.61 90 top
R62  95.25,24.77 180 top
R63  106.68,16.51 0 top
R64  95.25,43.81 180 top
R65  106.68,36.2 0 top
S1  327.02,92.08 0 top
S2  327.02,70.48 0 top
S3  327.02,47.62 0 top
S4  327.02,18.41 0 top
T1  121.92,78.74 90 top
T2  121.92,55.88 90 top
T3  113.03,24.13 270 top
T4  113.03,43.81 270 top
TR1  112.39,120.65 180 top
U$1  DON'T TOUCH  [ESD]  100.97,120.02 0 top
U$3  [MUELLTONNE_10.00]  6.35,69.85 0 top
U$11  [CE_5MM]  26.67,74.93 0 top
U$12  [C_TICK-3MM]  19.05,76.2 0 top
X1  143.51,133.35 270 top
X2  143.51,77.47 270 top
X3  143.51,55.88 270 top
X4  143.51,39.37 270 top
X5  143.51,22.86 270 top

### Tracks (layer width: path | path; a pad name or v marks a point on that pad's centre or on a via)
+5V
  Bottom 1.27: IR1.3 C20.+ R24.2 D15.C R25.1
+9V
  Bottom 0.61: 349.88,70.48 349.88,65.41
  Bottom 1.016: R6.2 IC2.4 353.69,65.41 350.52,62.23 349.88,62.23 | 342.26,75.56 D2.C IC2.8 349.88,70.48 | 342.26,75.56 R5.2 337.19,75.56 R4.2 | R9.2 IC3.4 IC3.8 344.81,52.7 | 344.81,52.7 343.54,51.44 R8.2 341,53.98 339.73,55.24 R7.2 | R12.2 IC4.4 IC4.8 | IC4.8 344.81,27.3 D8.C 346.07,31.11 354.96,31.11 356.24,32.38 356.24,34.92 353.69,37.47 319.4,37.47 318.13,38.73 318.13,62.87 | R10.2 337.19,26.04 R11.2 IC4.8 | 318.13,62.87 318.13,121.28 | 318.13,121.28 318.13,132.72 319.4,133.99 G1.+ 328.3,131.44 333.38,131.44 | 344.81,52.7 D6.C 344.81,61.59 344.17,62.23 | 344.17,62.23 343.54,62.87 318.13,62.87 | R3.2 IC1.4 IC1.8 R2.2 337.19,97.16 R1.2 335.92,103.5 318.13,121.28 | C18.+ 348.62,136.53 347.35,135.25 | 347.35,135.25 Q1.1 337.19,135.25 333.38,131.44 | 347.35,135.25 R16.2 347.35,126.36 IC5.8 | R14.2 333.38,131.44 | D4.C 342.26,75.56 | 344.17,62.23 349.88,62.23 | 349.88,65.41 349.88,62.23
+12V  (via drill 0.5 pad 1.93, 0.5 pad 2.18, 0.6)
  Top 1.016: v34.29,8.89 v34.29,4.16 | v5.71,59.05 v5.71,67.31
  Top 1.27: v5.71,58.42 v5.71,59.05
  Bottom 1.016: 73.03,93.98 69.22,97.79 IC8.5 69.22,103.19 80.96,103.19 | C30.1 IC6.14 46.35,69.85 45.09,68.58 45.09,59.69 | C29.1 20.95,40.01 20.32,40.64 IC9.3 20.32,45.09 15.88,49.53 R36.2 15.88,60.17 18.73,62.87 18.73,64.77 | 64.14,102.23 64.14,103.19 | 22.89,4.16 v34.29,4.16 94.65,4.16 94.64,4.44 | 22.89,4.16 15.08,4.38 3.17,16.51 3.17,57.78 3.81,58.42 v5.71,58.42 | IC6.5 45.09,59.69 | 45.09,59.69 45.09,58.42 46.35,57.15 IC6.9 49.53,57.15 50.16,56.52 50.16,35.56 C31.1 46.35,30.48 46.35,27.3 | IC10.14 47.62,28.57 46.35,27.3 | 46.35,27.3 46.35,18.41 | 46.35,18.41 46.35,17.14 47.62,15.88 IC10.9 | IC10.5 46.35,18.41 | 59.79,103.67 58.36,102.23 C34.1 55.24,103.5 53.98,104.78 | IC7.7 42.55,133.35 | Q2.E 11.43,136.53 6.99,136.53 5.08,134.62 5.08,68.58 v5.71,67.31 | C21.+ 94.64,4.44 | IC13.16 78.74,31.11 C33.1 | C32.1 76.07,75.5 76.77,74.87 76.83,69.85 78.74,67.94 86.36,67.94 | 22.89,4.16 22.86,4.19 22.86,10.16 | 40.64,18.41 35.56,18.41 34.29,17.14 v34.29,8.89 | R44.2 22.86,10.16 | 22.86,10.16 R43.2 | 18.73,64.77 18.73,67.94 | R42.2 18.73,64.77 | 94.65,4.45 94.64,4.44
  Bottom 1.27: R26.2 33.02,104.14 32.38,104.78 | 32.38,104.78 31.75,105.41 R25.2 | R35.2 73.03,93.98 | IC8.16 59.05,104.14 59.79,103.67 60.55,103.19 64.14,103.19 69.22,103.19 | IC8.3 64.14,102.23 | 69.22,102.87 IC8.5 | 86.36,79.38 86.36,97.79 80.96,103.19 | 40.64,18.41 IC10.5 | 101.6,4.45 D26.C 104.14,12.06 104.78,12.7 104.78,18.41 104.08,19.11 104.08,19.34 93.73,19.34 92.71,20.32 92.71,31.11 | D27.C 92.71,31.11 | 92.71,31.11 85.72,31.11 84.45,32.38 LED7.A | 86.36,48.26 87.63,46.99 92.08,46.99 93.34,45.72 93.34,40.64 92.08,39.37 85.09,39.37 84.45,38.73 LED7.A | LED7.A 79.38,36.2 78.74,35.56 C33.1 | 101.6,4.45 139.06,4.45 148.59,13.97 148.59,17.14 | C19.1 42.55,125.73 42.55,104.78 | 53.98,104.78 42.55,104.78 | 42.55,104.78 32.38,104.78 | 101.6,4.45 94.65,4.45 | IC11.16 72.39,75.34 C32.1 | 5.08,68.58 18.1,68.58 18.73,67.94 18.73,72.07 R37.2
  Bottom 1.422: K2.11 126.36,21.59 128.91,24.13 128.91,33.02 126.36,35.56 | 86.36,60.33 86.36,67.94 LED4.A 86.36,79.38 R50.1 | R53.1 86.36,60.33 | 86.36,60.33 LED5.A 86.36,48.26 | D26.C 87.63,12.06 LED6.A | C19.1 51.44,125.73 IC12.OUT | 42.55,125.73 42.55,133.35 LED2.A
  Bottom 1.676: K1.11 126.36,35.56 130.81,40.01 135.25,40.01 141.6,45.09 146.05,45.09 148.59,42.55 148.59,17.14 148.59,15.88
-12V
  Bottom 1.016: IC7.4 20.95,128.27 17.78,131.44 17.78,139.06 | 17.78,139.06 R30.1 | LED3.K 20.77,144.15 17.91,141.29 17.78,140.97 17.78,139.06
  Bottom 1.422: 51.44,144.15 R23.1 | D14.A 51.44,144.15 | 51.44,144.15 LED3.K
AGND
  Bottom 0.61: 349.88,45.09 349.88,41.27 | 353.69,122.56 353.69,120.02
  Bottom 1.016: S2.3 S2.4 330.56,67.94 335.92,67.94 | 355.98,58.7 C10.2 C11.2 351.15,59.05 | 355.98,58.7 362.58,53.98 362.58,37.47 361.31,36.2 358.77,36.2 | C13.2 C14.2 347.35,34.92 342.26,34.92 | 339.73,18.41 337.46,16.15 S4.4 S4.3 | 339.73,18.41 IC4.1 | S3.3 S3.4 330.56,45.09 343.54,45.09 IC3.1 346.07,45.09 347.35,46.35 348.62,46.35 349.88,45.09 | 342.26,34.92 341,33.66 341,31.11 339.73,29.84 333.38,29.84 332.11,28.57 332.11,26.04 339.73,18.41 | 342.26,34.92 319.4,34.92 318.13,33.66 318.13,13.34 320.68,10.79 361.31,10.79 363.86,13.34 363.86,27.3 358.77,32.38 358.77,36.2 | 349.88,41.27 351.15,40.01 356.24,38.73 358.77,36.2 | 355.6,81.28 357.5,79.38 361.31,79.38 362.58,78.11 362.58,65.3 355.98,58.7 | 355.6,81.28 C7.2 C8.2 347.35,83.19 | S1.3 S1.4 330.56,89.53 IC1.1 346.07,84.45 347.35,83.19 | 335.92,67.94 IC2.1 341,67.94 | C2.2 C1.2 | C1.2 354.96,104.78 358.77,100.97 361.31,100.97 R20.1 362.58,86.36 361.95,85.72 360.05,85.72 355.6,81.28 | D9.K 341,147.96 342.26,146.69 342.26,144.15 343.54,142.88 349.88,142.88 353.69,146.69 LED1.K C18.- 354.96,136.53 C16.2 354.96,123.83 353.69,122.56 | 347.35,83.19 343.54,79.38 334.64,79.38 333.38,78.11 333.38,76.83 335.92,74.3 335.92,67.94 | C1.2 353.69,106.05 352.43,107.31 337.19,107.31 323.21,121.28 G1.- 327.02,128.91 333.38,122.56 | 333.38,122.56 333.38,118.75 339.73,112.39 351.15,112.39 IC5.1 | 353.69,120.02 352.43,118.75 342.26,118.75 342.26,123.83 341,125.09 C17.2 335.92,125.09 333.38,122.56
GND  (via drill 0.5 pad 1.78, 0.5 pad 2.18)
  Top 1.016: v74.3,27.94 v74.3,15.24 | v76.83,100.97 v76.83,105.41 | v67.5,69.82 v67.47,55.85 | v43.18,57.15 v43.18,69.85 | v44.16,15.91 v44.13,28.51 | v71.75,41.27 v71.75,52.07 | v16.51,6.99 v16.51,1.91
  Top 1.27: v107.95,6.99 v107.95,1.91
  Bottom 0.813: IC7.3 23.5,130.81
  Bottom 1.016: Q3.E 10.79,91.44 8.89,93.34 8.89,96.52 10.16,97.79 IR1.2 | 74.3,109.86 76.83,109.86 v76.83,105.41 | IC8.8 v76.83,100.97 | v71.75,52.07 71.12,53.34 | C32.2 v67.5,69.82 | 41.27,13.97 IC10.7 IC10.8 | 41.27,13.97 IC10.6 44.13,15.88 v44.16,15.91 | 47.62,46.99 IC6.8 IC6.7 IC6.6 v43.18,57.15 | v43.18,69.85 43.18,74.3 C30.2 | IC11.8 IC11.9 | v67.47,55.85 IC11.7 62.87,55.88 62.23,56.52 62.23,59.05 60.33,60.96 60.33,81.92 arc90 59.05,83.19 52.7,83.19 arc90 51.44,81.92 51.44,76.83 | v44.13,28.51 43.81,29.84 C31.2 45.09,33.66 47.62,36.83 47.62,41.91 | R48.1 R49.2 70.48,9.53 IC13.8 | R45.1 32.38,47.62 33.02,46.99 47.62,46.99 | C34.2 55.24,109.86 | v107.95,1.91 v16.51,1.91 13.97,1.91 | 55.88,137.16 50.16,137.16 47.62,139.06 44.45,139.06 41.75,142.15 21.62,142.08 19.68,140.34 19.68,132.08 20.95,130.81 23.5,130.81 24.77,130.81 27.3,128.27 32.38,128.27 33.02,128.91 33.02,130.18 33.66,130.81 39.37,130.81 40.01,130.18 40.01,107.95 39.37,107.31 33.66,107.31 32.38,107.95 26.67,107.95 26.04,107.31 26.04,105.07 25.85,104.89 26.04,104.7 26.04,99.69 25.4,99.06 17.78,99.06 C20.- | 54.61,149.22 12.7,149.22 1.27,137.79 1.27,14.61 | D16.A 49.53,108.58 50.8,109.86 57.15,109.86 | C33.2 73.03,34.29 71.75,35.56 v71.75,41.27 | v16.51,6.99 16.51,13.97 R41.1 16.51,14.61 19.18,16.67 19.18,29.37 20.32,30.48 IC9.12 20.32,36.83 20.95,37.47 27.3,37.47 C29.2 36.83,34.92 37.47,35.56 37.43,41.72 38.07,42.35 47.18,42.35 47.62,41.91 | R47.1 41.27,13.97 | 47.62,41.91 47.62,46.99
  Bottom 1.27: 100.33,83.82 Q5.E 100.33,81.28 99.06,80.01 99.06,70.48 100.33,69.22 Q6.E 100.33,62.23 99.06,60.96 99.06,48.9 99.38,48.58 | IR1.2 C20.- | 55.24,109.86 57.15,109.86 74.3,109.86 85.09,109.86 87,107.95 87,102.23 89.53,99.69 89.53,91.44 90.81,90.17 99.06,90.17 100.22,89.01 100.22,88.77 | 55.88,130.81 55.88,133.99 | R31.1 55.24,118.75 55.88,120.02 | R22.2 55.88,133.99 | 55.88,133.99 55.88,137.16 55.88,147.32 54.61,149.22 | v107.95,6.99 107.95,20.32 106.68,21.59 97.79,21.59 97.16,22.23 97.16,26.67 98.42,27.94 107.31,27.94 107.31,39.37 106.68,40.01 98.42,40.01 97.79,40.64 97.79,46.99 99.38,48.58 | T4.E 111.12,46.35 110.49,46.99 100.97,46.99 99.38,48.58 | 13.97,1.91 1.27,14.61 | R28.1 D16.A | R46.1 51.44,76.83 51.44,77.47 50.8,78.11 43.81,78.11 42.55,76.83 C30.2
  Bottom 1.422: C19.2 55.88,130.81 IC12.GND 55.88,120.02 | 107.31,27.94 108.58,26.67 T3.E | v74.3,27.94 74.3,33.66 C33.2 | v74.3,15.24 IC13.7 IC13.8 IC13.9 | 71.12,53.34 IC11.9 | IC11.8 IC11.7 | Q5.E 100.33,88.66 100.22,88.77
  Bottom 1.676: 71.75,131.44 80.01,138.43 88.27,138.43 89.53,139.7 | TR1.9 102.08,130.66 103.5,132.08 103.5,138.43 101.6,140.34 90.17,140.34 89.53,139.7 | C5.- 71.75,146.69 arc-90 73.03,147.96 89.53,147.96 89.53,139.7 | C6.- 61.59,134.62 | R22.2 61.59,134.62 | 61.59,134.62 R21.2 D14.C
  Bottom 1.93: C6.- 69.85,134.62
  Bottom 2.184: C4.- 71.75,131.44 71.75,133.99 71.12,134.62 C6.- | TR1.9 97.38,120.88 97.16,120.65 97.16,110.87 TR1.13
  pour Bottom (isolate 1.422): -1.27,152.4 152.4,152.4 152.4,127 152.4,-1.91 -1.91,-1.91 -1.91,152.4
N$1
  Bottom 1.016: C1.1 IC1.5
N$2  (via drill 0.5 pad 3.81)
  Top 1.27: v343.54,87 v348.62,87
  Bottom 1.016: C3.1 328.3,98.42 329.56,97.16 332.11,97.16 333.38,95.89 333.38,93.34 332.11,92.08 321.94,92.08 320.68,90.81 320.68,88.27 321.94,87 R2.1
  Bottom 1.27: R2.1 D2.A v343.54,87 | v348.62,87 IC1.2
N$3
  Bottom 1.016: R3.1 357.5,95.89 356.24,94.61 352.43,94.61 351.15,95.89 IC1.6 IC1.7 C2.1
N$4
  Bottom 1.016: S1.2 S1.1 323.21,94.89 R1.1 C3.2
N$5
  Bottom 1.016: IC1.3 351.15,88.27 352.43,87 358.77,87 360.05,88.27 D1.A
N$6
  Bottom 1.016: R13.1 329.56,118.75 338.45,109.86 356.24,109.86 357.5,111.12 IC5.3
N$7
  Bottom 1.016: IC2.5 C7.1
N$8
  Bottom 1.016: IC2.2 347.35,65.41 D4.A R5.1 321.94,65.41 320.68,66.67 320.68,69.22 321.94,70.48 332.11,70.48 333.38,71.75 333.38,74.3 332.11,75.56 329.56,75.56 328.3,76.83 C9.1
N$9
  Bottom 1.016: C8.1 IC2.7 IC2.6 351.15,74.3 352.43,73.03 354.96,73.03 R6.1
N$10
  Bottom 1.016: S2.2 S2.1 323.21,72.75 R4.1 C9.2
N$11
  Bottom 1.016: D3.A 356.24,70.48 352.43,70.48 IC2.3
N$12
  Bottom 1.016: 365.12,59.05 365.12,36.2 362.58,33.66 D7.C | D5.C 365.12,59.05 | 365.12,59.05 365.12,82.55 | 365.12,82.55 D3.C | 365.12,82.55 365.12,103.5 363.86,104.78 D1.C 360.05,109.86 | 360.05,109.86 IC5.4 | R20.2 360.05,109.86
N$13
  Bottom 1.016: C10.1 IC3.5
N$14
  Bottom 1.016: IC3.2 347.98,41.27 R8.1 321.94,41.27 320.68,42.55 320.68,46.35 321.94,47.62 332.11,47.62 333.38,48.9 333.38,51.44 332.11,52.7 328.3,52.7 327.02,53.98 327.02,59.05 C12.1 D6.A
N$15
  Bottom 1.016: R9.1 357.5,50.16 356.24,48.9 352.43,48.9 351.15,50.16 IC3.6 IC3.7 C11.1
N$16
  Bottom 1.016: C12.2 R7.1 323.21,51.16 324.49,49.89 | S3.2 324.49,49.89 | 324.49,49.89 S3.1
N$17
  Bottom 1.016: IC3.3 353.69,41.27 358.77,41.27 360.05,42.55 D5.A
N$18
  Bottom 1.016: Q1.3 R18.2
N$19
  Bottom 1.016: C13.1 IC4.5
N$20
  Bottom 1.016: IC4.2 348.62,17.14 347.35,15.88 R11.1 338.45,13.34 321.94,13.34 320.68,14.61 320.68,17.14 321.94,18.41 332.11,18.41 333.38,19.68 333.38,22.23 332.11,23.5 327.02,23.5 325.75,24.77 325.75,29.84 C15.1 D8.A
N$21
  Bottom 1.016: C14.1 IC4.7 IC4.6 351.15,24.77 352.43,23.5 354.96,23.5 R12.1
N$22
  Bottom 1.016: C15.2 R10.1 323.21,21.23 S4.1 S4.2
N$23
  Bottom 1.016: IC4.3 353.69,14.61 358.77,14.61 361.31,17.14 D7.A
N$24
  Bottom 1.016: R17.A R15.2
N$25
  Bottom 1.016: IC5.5 C16.1
N$26
  Bottom 1.016: IC5.6 357.5,120.02 IC5.2 | IC5.2 356.24,117.47 361.31,117.47 R15.1 | IC5.2 354.96,114.94 353.69,116.2 341,116.2 339.73,117.47 C17.1
N$27
  Bottom 1.016: R17.E R17.S R16.1 360.05,128.91 357.5,126.36 357.5,123.83 IC5.7
N$28
  Bottom 1.016: R13.2 R14.1 Q1.2
N$29
  Bottom 1.016: R19.2 334.64,145.41 D9.A 325.75,147.96 323.21,144.78 R18.1
N$30
  Bottom 1.016: R19.1 LED1.A
N$31
  Bottom 1.93: TR1.1 141.2,105.64 143.51,107.95 F1.2
  Bottom 2.184: X1.2 F1.2
N$32
  Bottom 1.422: R57.2 120.02,71.12 | 120.02,71.12 R61.2 130.18,57.15 128.91,55.88 T2.T2 114.94,55.88 111.76,59.05 R60.2 | 120.02,71.12 120.02,76.83 121.92,78.74 T1.T2 126.36,78.74 130.81,82.55 R58.2 | 130.81,90.71 129.97,90.92
  Bottom 1.676: R58.2 130.81,90.71
  Bottom 2.184: 130.1,90.86 129.97,90.92 121.6,98.11 121.28,101.6 121.28,111.12 127,116.84 127,135.25 TR1.7 141.81,135.66 X1.1
N$33
  Bottom 1.27: R27.1 Q3.B
N$34
  Bottom 1.676: TR1.14 92.48,105.64 91.44,106.68 91.44,123.19 90.17,124.46 81.28,124.46 80.64,125.09 D10.A
  Bottom 1.93: D12.C D10.A
N$35
  Bottom 1.676: 97.16,135.25 TR1.8 96.98,135.25 91.44,135.25 89.53,133.35 D13.C
  Bottom 1.93: D13.C D11.A
N$36
  Bottom 1.422: C6.+ 66.04,125.73 | IC12.IN 60.33,125.73 66.04,125.73 | 66.04,125.73 66.04,120.65 67.31,119.38 C4.+
  Bottom 1.93: D10.C D11.C
  Bottom 2.184: D10.C C4.+
N$37
  Bottom 1.676: C5.+ 68.58,139.7 67.31,140.97 67.31,145.41 66.04,146.69 R23.2
  Bottom 1.93: D13.A D12.A 73.66,139.7 C5.+
N$38
  Bottom 1.016: R21.1 50.8,139.7 48.26,141.6 LED3.A
N$39
  Bottom 1.016: R27.2 10.16,88.9 6.95,92.08 6.95,97.79 9.53,100.33
  Bottom 1.27: 22.86,105.41 R24.1 13.97,105.41 11.43,102.23 IR1.1 9.53,100.33
N$40
  Bottom 1.016: IC6.3 35.56,64.77 31.11,60.96 27.05,60.99 | IC9.2 22.86,45.72 18.67,50.16 18.67,59.05 20.54,61.02 27.05,60.99 | 27.05,60.99 27.1,68.58 29.21,70.7 R37.1
N$41
  Bottom 1.27: R22.1 49.53,134.62 LED2.K
N$42
  Bottom 1.016: Q2.B 8.26,133.35 7.62,132.72 R29.2
N$43
  Bottom 1.27: 22.86,125.09 D18.C 17.14,125.09 | 17.14,125.09 12.7,125.09 12.06,125.73 Q2.C | R30.2 17.14,125.09
N$44
  Bottom 1.016: R31.2 36.2,125.09 | 36.2,125.09 R32.2 | D18.A 36.2,125.09
N$45  (via drill 0.5 pad 1.78)
  Top 1.016: v24.77,127.64 v24.77,134.62
  Bottom 1.016: 20.95,121.92 R33.1 26.04,126.36 v24.77,127.64 | IC7.2 23.5,133.35 v24.77,134.62 24.77,138.43 26.04,139.7 34.29,139.7 R32.1 | C23.1 20.95,121.92 | Q4.E 15.24,121.28 15.88,121.92 20.95,121.92
N$46  (via drill 0.5 pad 2.18)
  Top 1.016: v45.09,52.07 v52.7,52.07
  Bottom 1.016: D23.C 36.2,59.69 37.27,58.42 37.27,52.7 38.1,52.07 v45.09,52.07 | IC6.10 R46.2 52.7,58.42 52.7,53.98 | 52.7,53.98 v52.7,52.07 | D20.C 52.7,53.98
N$47
  Bottom 1.016: IC8.4 66.67,97.16 69.22,94.61 69.22,91.44 68.58,90.81 53.34,90.81 52.7,91.44 52.7,93.34 | 52.7,93.34 52.7,100.33 51.44,101.6 34.92,101.6 33.66,100.33 R26.1 33.66,88.9 31.11,86.36 Q3.C | C22.1 52.7,93.34
  Bottom 1.27: Q3.C 26.04,85.09 8.89,85.09 7.62,86.36 R29.1
N$48  (via drill 0.5 pad 1.78, 0.5 pad 2.18)
  Top 1.016: v40.07,139.79 v40.07,146.69 | v10.16,111.76 v3.17,111.76
  Bottom 1.016: IC7.6 27.94,130.81 27.3,131.44 27.3,137.16 27.94,137.79 31.75,137.79 32.38,137.16 32.38,135.89 33.02,135.25 39.37,135.25 40.01,135.89 40.01,139.73 v40.07,139.79 | v40.07,146.69 12.7,146.69 3.17,137.16 v3.17,111.76 3.17,62.23 3.81,61.59 10.41,61.56 11.05,60.93 11.05,48.39 15.24,44.45 IC9.5 15.24,39.37 14.61,38.73 | Q4.C C23.2 25.4,114.3 26.04,113.67 R33.2 v10.16,111.76 | 14.61,38.73 13.34,38.73 12.06,38.73 | 12.06,38.73 10.79,38.73 10.16,39.37 IC9.7 | IC9.9 12.7,38.1 12.06,38.73 | IC9.11 17.78,38.1 17.14,38.73 14.61,38.73
N$49
  Bottom 1.016: R34.1 33.66,110.49 33.02,111.12 33.02,116.2 32.38,116.84 Q4.B
N$50  (via drill 1 pad 3.81)
  other vias: 97.16,120.65
N$51
  Bottom 1.27: IC8.2 C24.+ R35.1
N$52
  Bottom 1.27: C24.- IC8.1
N$53
  Bottom 1.016: R38.2 13.34,64.77 | 13.34,64.77 R36.1 | 13.14,64.58 13.33,64.77 | 13.33,64.77 13.33,62.17 13.34,62.17 13.34,49.21 17.78,44.77 IC9.4 | 13.33,64.77 13.34,64.77
N$54
  Bottom 1.016: 13.34,24.77 R41.2 | R40.1 12.06,14.61 13.34,15.88 13.34,24.77 | 13.34,24.77 13.34,29.84 15.24,31.75 IC9.10
N$55
  Bottom 1.016: R39.1 IC9.8 R40.2
N$56
  Bottom 1.016: 8.26,55.24 R38.1 8.26,45.12 | R39.2 8.26,45.12 | 8.26,45.12 11.08,45.12 12.7,43.81 IC9.6
N$57  (via drill 0.5 pad 2.18)
  Top 1.016: v52.7,49.24 v45.09,49.24
  Bottom 1.016: v52.7,49.24 57.5,49.24 57.78,49.53 57.78,56.52 55.24,59.05 55.24,61.59 arc90 53.98,62.87 48.26,62.87 arc90 IC6.11 | v45.09,49.24 36.07,49.31 35.15,50.23 35.15,56.29 33.02,58.42 22.23,58.42 21.59,57.78 R42.1 21.56,50.48 25.4,46.35 IC9.1
N$58
  Bottom 1.016: 30.48,23.5 R43.1 | IC10.3 30.48,23.5 | IC9.14 25.4,31.11 26.04,30.48 29.84,30.48 30.48,29.84 30.48,23.5
N$59
  Bottom 1.016: IC9.13 R44.1 22.86,20.95 26.04,17.78 26.04,6.99 26.67,6.35 56.52,6.35 57.15,6.99 57.15,20.32 56.52,20.95 IC10.11
N$60
  Bottom 1.016: IC11.6 IC11.5 64.14,61.59 62.87,61.59 62.23,62.23 62.23,83.19 arc90 60.33,85.09 38.1,85.09 arc90 36.2,82.55 D23.A 36.83,69.85 IC6.1
N$61
  Bottom 1.016: 73.03,55.88 IC11.10 74.55,54.8 74.55,50.13 73.91,49.5 60.33,49.5 arc-90 60.17,49.4 60.17,57.69 57.78,60.33 57.78,64.14 arc90 56.52,65.41 50.8,65.41 arc-90 50.16,66.04 arc90 48.9,67.31 IC6.13
  Bottom 1.27: D24.A 59.69,40.01 60.33,40.64 60.33,49.5
  Bottom 1.422: IC11.10 IC11.11
N$62
  Bottom 1.422: Q5.B 97.79,85.72 95.89,87.63 91.44,87.63 90.17,86.36 R52.2
N$63
  Bottom 1.016: IC13.10 80.01,15.24 80.64,14.61 80.64,7.62 79.38,6.35 60.33,6.35 59.69,6.99 59.69,24.77 58.42,26.04 IC10.13
  Bottom 1.422: IC13.11 IC13.10
N$64
  Bottom 1.016: IC11.4 IC11.12 75.56,60.87 76.2,60.23 76.14,48.16 75.44,47.5 66.67,47.56 64.77,45.65 64.77,24.13 66.04,22.86 IC13.4 IC13.12 82.55,20.32 83.19,19.68 83.19,10.16 R49.1 C21.-
N$65  (via drill 0.5 pad 2.18)
  Top 1.016: v51.44,30.48 v41.27,30.48
  Bottom 1.016: IC13.5 63.5,20.32 | v41.27,30.48 IC10.1 | D25.A 63.5,20.32 | v51.44,30.48 52.07,30.48 53.34,29.21 60.33,29.21 62.23,27.3 62.23,21.59 63.5,20.32
  Bottom 1.422: IC13.6 IC13.5
N$66
  Bottom 1.016: IC11.1 64.77,85.72 66.04,87 R52.1 80.64,87
N$67  (via drill 2.8 pad 3.81)
  other vias: 4.45,146.05
N$68
  Bottom 1.016: LED4.K 83.82,74.93 83.19,75.56 R51.1
N$69
  Bottom 1.27: Q5.C 95.25,82.55 96.52,81.28 96.52,77.47 95.25,76.2 OK1.2
  Bottom 1.422: R51.2 OK1.2
N$70
  Bottom 1.016: Q6.B 97.79,67.31
  Bottom 1.422: 97.79,67.31 95.25,69.85 92.08,69.85 90.17,67.94 R55.2
N$71
  Bottom 1.016: R55.1 78.74,64.77 74.93,68.58 IC11.15
N$72
  Bottom 1.016: LED5.K 83.82,55.24 83.19,55.88 R54.1
N$73
  Bottom 1.27: R54.2 OK2.2 95.25,55.88 96.52,57.15 96.52,60.96 95.25,62.23 Q6.C
N$74
  Bottom 1.422: OK1.1 92.71,79.38 R50.2
N$75
  Bottom 1.27: OK2.1 92.08,60.33 R53.2
N$76
  Bottom 1.93: 148.59,93.98 145.41,97.16 F1.1
  Bottom 2.184: X3.2 145.47,53.39 148.59,55.24 148.59,74.93 | 148.59,74.93 148.59,93.98 | X2.2 145.36,74.98 148.59,74.93
N$77
  Bottom 1.27: R59.2 R60.1
  Bottom 1.422: C27.1 118.87,49.4 116.84,50.8 R60.1
N$78
  Bottom 1.27: R57.1 111.12,76.83 R56.2
  Bottom 1.422: C25.1 108.58,66.67 106.05,69.22 R56.2
N$79
  Bottom 1.422: C26.2 134.62,81.92 128.91,76.2 T1.T1 124.46,71.75 128.91,66.67 C25.2
  Bottom 1.676: X2.1 143.51,82.55 142.24,83.82 C26.2
N$80
  Bottom 1.93: C26.1 R58.1
N$81
  Bottom 1.422: C28.2 133.99,54.61 132.72,53.34 T2.T1 124.46,46.35 127,43.81 C27.2
  Bottom 1.676: 141.6,59.69 142.22,59.69 X3.1
  Bottom 1.93: 141.6,59.69 C28.2
N$82
  Bottom 1.422: T1.G 124.46,83.82 122.56,85.72 110.49,85.72 108.9,83.82 108.9,78.87 103.5,73.03 OK1.4
N$83
  Bottom 1.27: K2.12 121.28,24.13 121.92,24.77 125.09,24.77 126.36,26.04 126.36,31.11
  Bottom 1.422: T3.C 114.3,21.59 115.57,22.86 115.57,30.48 116.84,31.75 124.7,31.75 126.36,31.11
  Bottom 1.676: T3.C R63.2 D26.A
N$84
  Bottom 1.93: C28.1 R61.1
N$85
  Bottom 1.27: 121.92,63.5 110.49,63.5 109.22,62.23 109.22,57.15 105.41,53.34
  Bottom 1.422: T2.G 124.46,60.96 121.92,63.5 | 105.41,53.34 OK2.4
N$86
  Bottom 1.422: OK1.6 103.5,78.11 R56.1
N$87
  Bottom 1.422: OK2.6 104.14,58.42 R59.1
N$88
  Bottom 1.27: R62.1 106.68,24.77 107.31,24.13 T3.B
N$89
  Bottom 1.27: 121.28,12.7 122.56,10.79 135.25,10.79
  Bottom 1.422: 135.25,10.79 136.53,10.79 142.88,17.14 X5.2
  Bottom 1.676: 121.28,12.7 K2.1
N$90
  Bottom 1.676: K2.7 136.53,21.59 140.34,25.4 142.85,25.4
  Bottom 2.184: 142.85,25.4 X5.1
N$91
  Bottom 1.27: R63.1 LED6.K
N$92
  Bottom 1.27: D27.A R65.2 T4.C
  Bottom 1.422: 121.28,36.83 K1.12 116.2,35.56 115.57,36.2 115.57,40.64 114.94,41.27 T4.C
N$93
  Bottom 1.422: T4.B R64.1
N$94
  Bottom 1.676: K1.7 135.25,35.56 142.88,41.91 143.49,41.91 X4.1
N$95
  Bottom 1.422: X4.2 143.51,32.38 142.24,31.75 133.99,31.75 131.44,29.21 131.44,22.86 126.36,17.78 120.02,17.78 118.75,19.05 118.75,26.67 120.02,27.94
  Bottom 1.676: 120.02,27.94 K1.1
N$96
  Bottom 1.422: R65.1 LED7.K
N$97
  Bottom 1.016: R64.2 69.85,43.81 69.22,43.18 69.22,31.11 69.85,30.48 IC13.1
N$98
  Bottom 1.016: R62.2 81.92,24.77 81.28,25.4 81.28,27.3 80.64,27.94 IC13.15
N$99  (via drill 2.8 pad 3.81)
  other vias: 146.05,146.05
N$100  (via drill 2.8 pad 3.81)
  other vias: 146.05,4.45
N$101  (via drill 2.8 pad 3.81)
  other vias: 4.45,4.45
N$102
  Bottom 1.27: 0,140.97 0,150.5 8.89,150.5
N$103
  Bottom 1.27: 150.5,142.24 150.5,150.5 142.88,150.5
N$104
  Bottom 1.016: IC11.3 69.91,64.33 | 69.91,64.33 IC11.13 76.83,63.5 77.72,62.74 77.72,46.86 76.61,46.02 | IC13.13 IC13.3 67.31,25.4 66.67,26.04 66.67,44.45 67.94,45.72 76.3,45.72 76.61,46.02 | 76.61,46.02 76.2,45.72 | IC8.7 74.3,97.47 74.93,96.84 83.22,96.84 83.85,96.2 83.82,85.09 arc-90 83.06,83.82 71.63,83.82 arc90 69.88,82.3 69.85,69.18 69.85,64.39 69.91,64.33
N$105
  Bottom 1.27: 150.5,8.26 150.5,0 142.24,0
N$106
  Bottom 1.27: 8.26,0 0,0 0,8.26
N$109
  Bottom 1.016: R48.2 D25.C 53.98,13.34 54.61,13.97 D22.C 53.98,18.41 IC10.10
N$110
  Bottom 1.016: IC6.4 41.91,62.23 42.55,62.87 42.55,66.67 41.91,67.31 R45.2 D19.C
N$111  (via drill 0.5 pad 1.78, 0.5 pad 2.18)
  Top 1.016: v24.7,63.18 v24.7,56.1 | v52.86,44.7 v45.15,44.74 | v55.88,87 v55.88,80.64
  Bottom 1.016: D20.A 55.88,70.48 v55.88,80.64 | D21.A 33.66,44.45 34.42,44.7 arc90 34.45,44.67 | v52.86,44.7 52.86,35.4 D22.A | 45.09,97.79 C22.2 45.09,87 | 45.09,87 v55.88,87 | D19.A 29.21,54.61 | 29.21,54.61 29.24,45.72 30.35,44.67 34.45,44.67 | v24.7,56.1 25.11,55.88 29.21,55.88 29.21,54.61 | 45.09,87 36.83,87 arc90 33.66,83.82 arc-90 31.11,81.92 26.04,81.92 arc90 24.77,80.64 24.77,63.25 arc-90 v24.7,63.18 | v45.15,44.74 34.58,44.74 arc90 34.51,44.67 34.45,44.67
  Bottom 1.27: D16.C R28.2 45.09,97.79 R34.2
N$112
  Bottom 1.016: IC10.4 43.18,20.95 43.81,21.59 43.81,25.4 43.18,26.04 38.1,26.04 R47.2 37.47,32.38 40.01,34.92 40.01,37.47 40.64,38.1 D21.C D24.C

### Text on the board
Bottom: BOUSSAMA MOHAMED | -12V | AC 220V | +12V | DON'T TOUCH | RECEPTEUR | MP 2016/17 | ENIT Lab | EMETTEUR | +12V